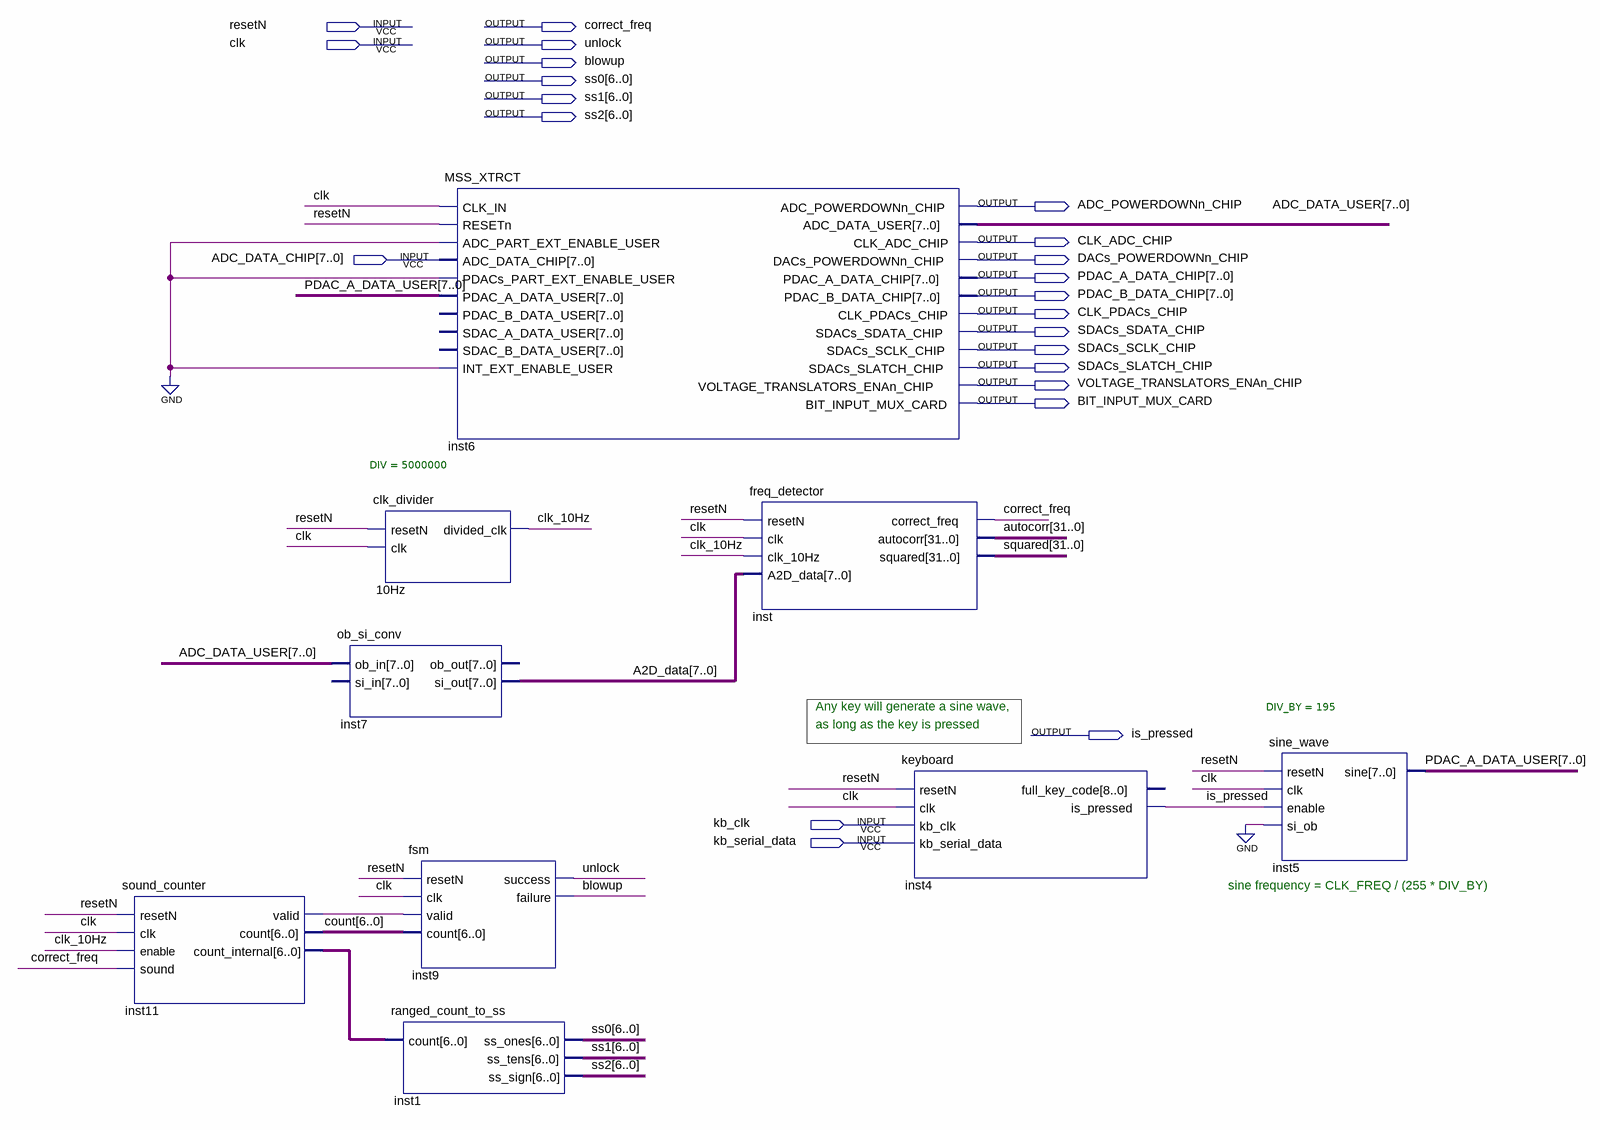
[diagram p0: schematic sheet]
// Quartus schematic sine_wave_generation_with_freq_detector.bdf as structural Verilog: 9 symbols, 23 pins
module sine_wave_generation_with_freq_detector (
  input  resetN,
  input  clk,
  input  [7:0] ADC_DATA_CHIP,
  input  kb_clk,
  input  kb_serial_data,
  output correct_freq,
  output unlock,
  output blowup,
  output [6:0] ss0,
  output [6:0] ss1,
  output [6:0] ss2,
  output ADC_POWERDOWNn_CHIP,
  output CLK_ADC_CHIP,
  output DACs_POWERDOWNn_CHIP,
  output [7:0] PDAC_A_DATA_CHIP,
  output [7:0] PDAC_B_DATA_CHIP,
  output CLK_PDACs_CHIP,
  output SDACs_SDATA_CHIP,
  output SDACs_SCLK_CHIP,
  output SDACs_SLATCH_CHIP,
  output VOLTAGE_TRANSLATORS_ENAn_CHIP,
  output BIT_INPUT_MUX_CARD,
  output is_pressed
);

  wire clk_10Hz, inst11_valid;
  wire [6:0] count, inst11_count_internal;
  wire [7:0] A2D_data, ADC_DATA_USER, PDAC_A_DATA_USER;
  wire [31:0] autocorr, squared;

  sound_counter inst11 (
    .resetN(resetN), .clk(clk), .enable(clk_10Hz), .sound(correct_freq), .valid(inst11_valid), .count(count),
    .count_internal(inst11_count_internal));
  clk_divider #(.DIV(5000000)) u_10Hz (.resetN(resetN), .clk(clk), .divided_clk(clk_10Hz));
  ob_si_conv inst7 (.ob_in(ADC_DATA_USER), .si_out(A2D_data));  // open: si_in, ob_out
  ranged_count_to_ss inst1 (.count(inst11_count_internal), .ss_ones(ss0), .ss_tens(ss1), .ss_sign(ss2));
  MSS_XTRCT inst6 (
    .CLK_IN(clk), .RESETn(resetN), .ADC_PART_EXT_ENABLE_USER(1'b0), .ADC_DATA_CHIP(ADC_DATA_CHIP),
    .PDACs_PART_EXT_ENABLE_USER(1'b0), .PDAC_A_DATA_USER(PDAC_A_DATA_USER), .INT_EXT_ENABLE_USER(1'b0),
    .ADC_POWERDOWNn_CHIP(ADC_POWERDOWNn_CHIP), .ADC_DATA_USER(ADC_DATA_USER), .CLK_ADC_CHIP(CLK_ADC_CHIP),
    .DACs_POWERDOWNn_CHIP(DACs_POWERDOWNn_CHIP), .PDAC_A_DATA_CHIP(PDAC_A_DATA_CHIP),
    .PDAC_B_DATA_CHIP(PDAC_B_DATA_CHIP), .CLK_PDACs_CHIP(CLK_PDACs_CHIP),
    .SDACs_SDATA_CHIP(SDACs_SDATA_CHIP), .SDACs_SCLK_CHIP(SDACs_SCLK_CHIP),
    .SDACs_SLATCH_CHIP(SDACs_SLATCH_CHIP), .VOLTAGE_TRANSLATORS_ENAn_CHIP(VOLTAGE_TRANSLATORS_ENAn_CHIP),
    .BIT_INPUT_MUX_CARD(BIT_INPUT_MUX_CARD));  // open: PDAC_B_DATA_USER, SDAC_A_DATA_USER, SDAC_B_DATA_USER
  fsm inst9 (.resetN(resetN), .clk(clk), .valid(inst11_valid), .count(count), .success(unlock), .failure(blowup));
  freq_detector inst (
    .resetN(resetN), .clk(clk), .clk_10Hz(clk_10Hz), .A2D_data(A2D_data), .correct_freq(correct_freq),
    .autocorr(autocorr), .squared(squared));
  keyboard inst4 (
    .resetN(resetN), .clk(clk), .kb_clk(kb_clk), .kb_serial_data(kb_serial_data), .is_pressed(is_pressed));  // open: full_key_code
  sine_wave #(.DIV_BY(195)) inst5 (
    .resetN(resetN), .clk(clk), .enable(is_pressed), .si_ob(1'b0), .sine(PDAC_A_DATA_USER));

  // Notes on the sheet:
  //   Any key will generate a sine wave,
  //   as long as the key is pressed
  //   sine frequency = CLK_FREQ / (255 * DIV_BY)
endmodule
